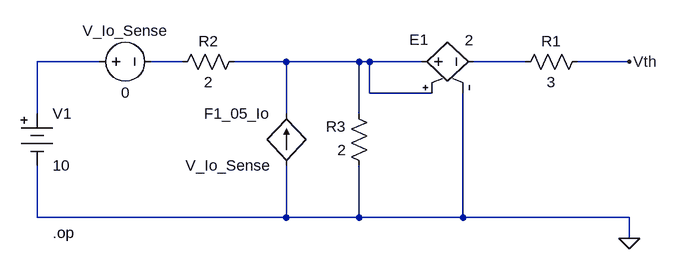
[diagram p0: schematic g3_p19_Vth.asc]
g3_p19_Vth.asc, the LTspice schematic file:
Version 4
SHEET 1 880 680
WIRE -240 96 -336 96
WIRE -112 96 -160 96
WIRE 48 96 -32 96
WIRE 160 96 48 96
WIRE 176 96 160 96
WIRE 256 96 176 96
WIRE 416 96 336 96
WIRE 576 96 496 96
WIRE 176 144 176 96
WIRE 272 144 176 144
WIRE -336 176 -336 96
WIRE 48 176 48 96
WIRE 160 176 160 96
WIRE -336 336 -336 256
WIRE 48 336 48 256
WIRE 48 336 -336 336
WIRE 160 336 160 256
WIRE 160 336 48 336
WIRE 320 336 320 144
WIRE 320 336 160 336
WIRE 576 336 320 336
WIRE 576 368 576 336
FLAG 576 96 Vth
FLAG 576 368 0
SYMBOL res 512 80 R90
WINDOW 0 0 56 VBottom 2
WINDOW 3 32 56 VTop 2
SYMATTR InstName R1
SYMATTR Value 3
SYMBOL res -16 80 R90
WINDOW 0 0 56 VBottom 2
WINDOW 3 32 56 VTop 2
SYMATTR InstName R2
SYMATTR Value 2
SYMBOL res 176 272 R180
WINDOW 0 36 76 Left 2
WINDOW 3 36 40 Left 2
SYMATTR InstName R3
SYMATTR Value 2
SYMBOL Misc\\battery -336 160 R0
SYMATTR InstName V1
SYMATTR Value 10
SYMBOL f 48 256 R180
WINDOW 0 24 80 Left 2
WINDOW 3 24 0 Left 2
SYMATTR InstName F1_05_Io
SYMATTR Value V_Io_Sense
SYMATTR Value2 0.5
SYMBOL e 240 96 R270
WINDOW 0 34 -3 VRight 2
WINDOW 3 33 83 VRight 2
SYMATTR InstName E1
SYMATTR Value 2
SYMBOL voltage -256 96 R270
WINDOW 0 32 56 VTop 2
WINDOW 3 -32 56 VBottom 2
SYMATTR InstName V_Io_Sense
SYMATTR Value 0
TEXT -312 360 Left 2 !.op

The netlist it stands for:
* g3_p19_Vth.asc
R1 Vth N004 3
R2 N003 N002 2
R3 0 N003 2
V1 N001 0 10
F1_05_Io 0 N003 V_Io_Sense 0.5
E1 N003 N004 N003 0 2
V_Io_Sense N001 N002 0
.op
.backanno
.end